# EAGLE design main (EAGLE 6.5.0)
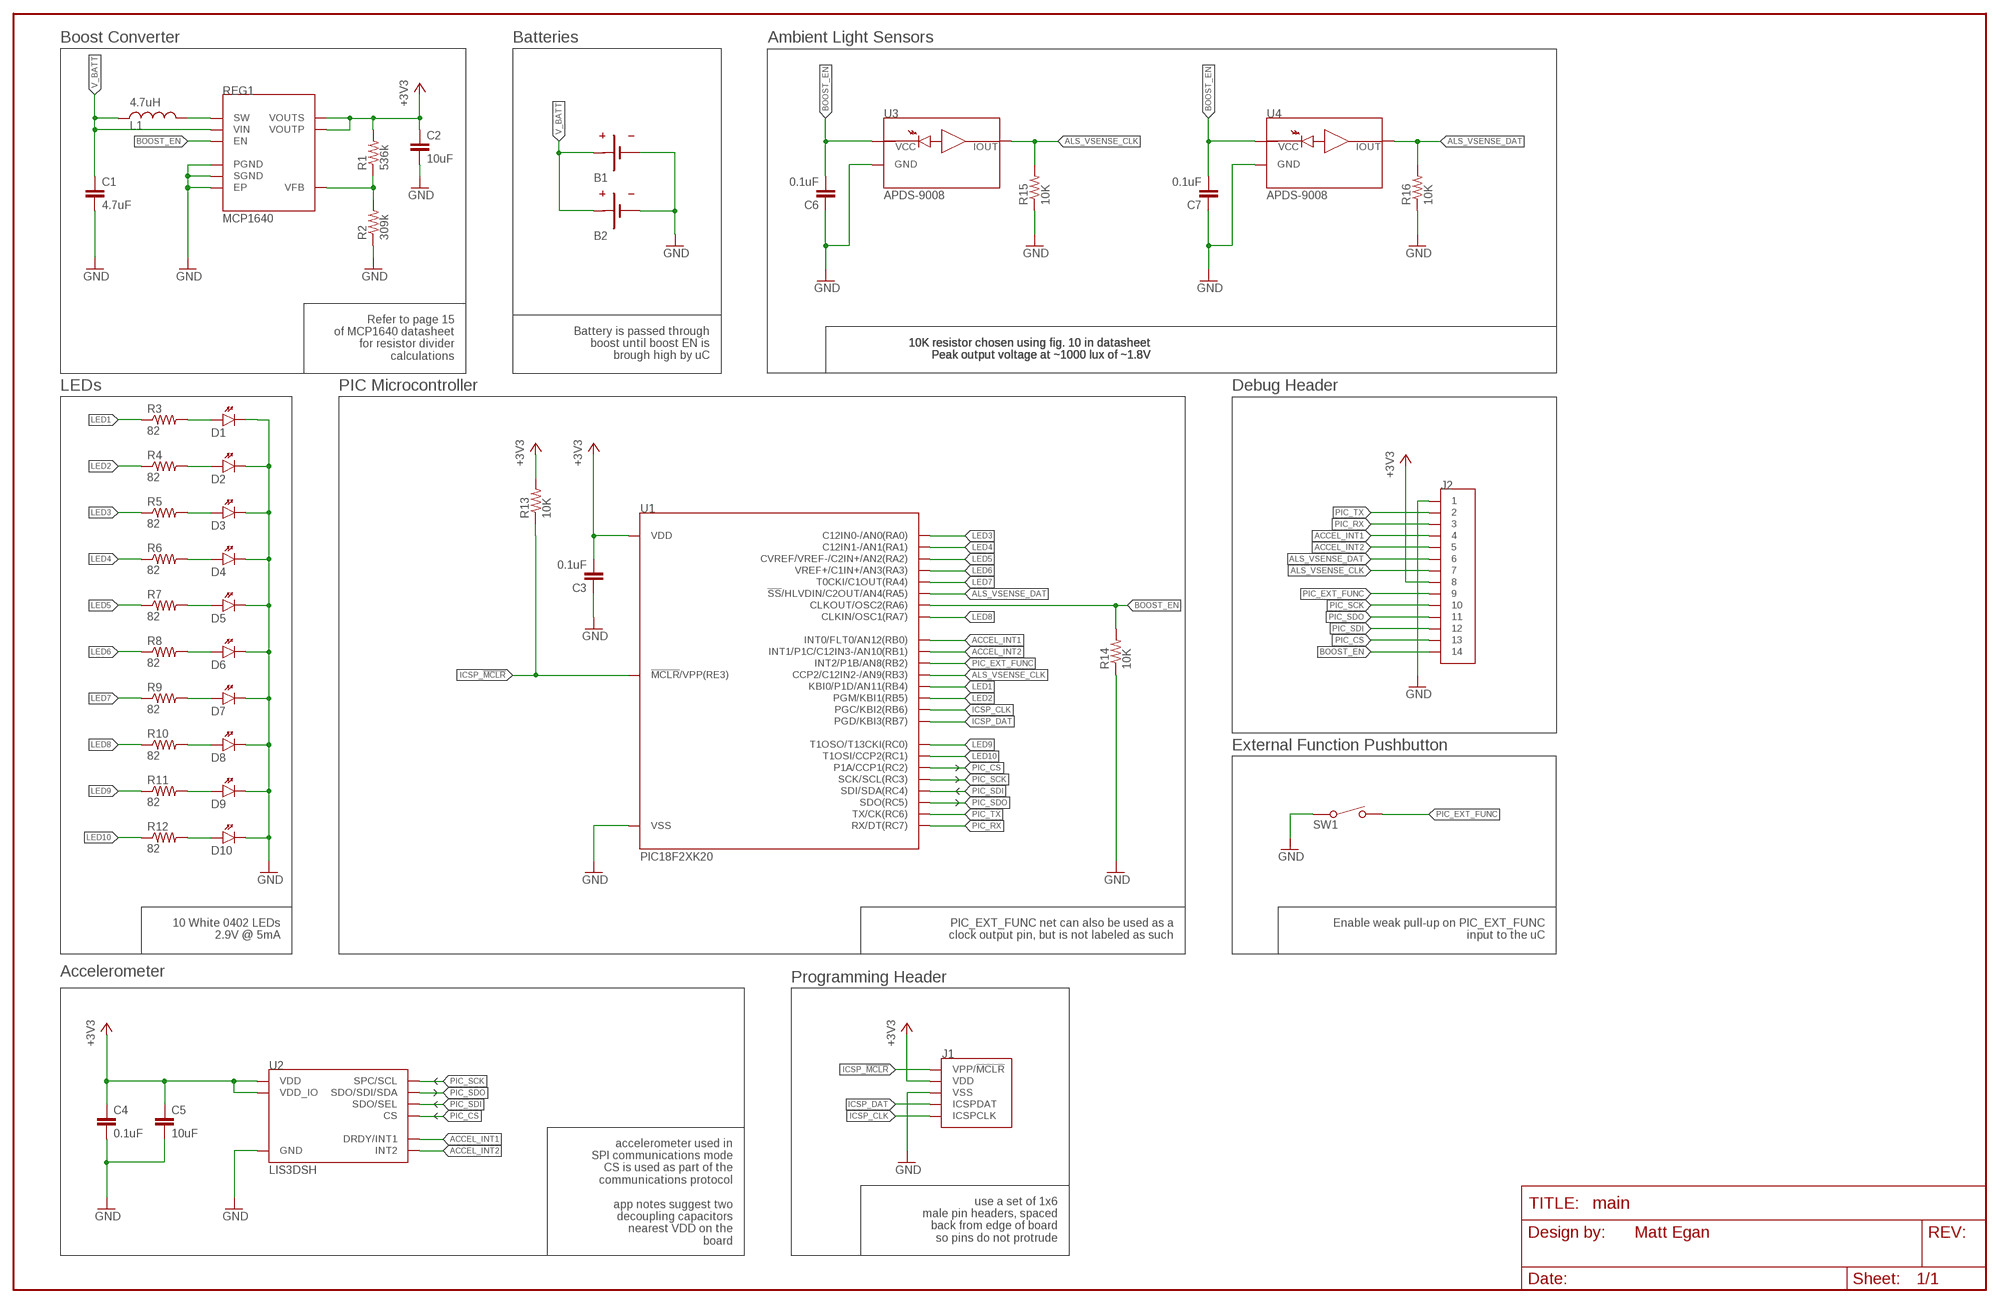
[diagram p0: schematic, sheet 1]

## Parts
B1  BATTERYCR-2016/F2N  [CR-2016/F2N]
B2  BATTERYCR-2016/F2N  [CR-2016/F2N]
C1  4.7uF  CAPACITOR0603  [SMD-0603]
C2  10uF  CAPACITOR0603  [SMD-0603]
C3  0.1uF  CAPACITOR0805  [SMD-0805]
C4  0.1uF  CAPACITOR0805  [SMD-0805]
C5  10uF  CAPACITOR0805  [SMD-0805]
C6  0.1uF  CAPACITOR0805  [SMD-0805]
C7  0.1uF  CAPACITOR0805  [SMD-0805]
D1  LED0603  [SMD-0603-P]
D2  LED0603  [SMD-0603-P]
D3  LED0603  [SMD-0603-P]
D4  LED0603  [SMD-0603-P]
D5  LED0603  [SMD-0603-P]
D6  LED0603  [SMD-0603-P]
D7  LED0603  [SMD-0603-P]
D8  LED0603  [SMD-0603-P]
D9  LED0603  [SMD-0603-P]
D10  LED0603  [SMD-0603-P]
J1  ICSP-HEADER1X6-0.1-ICSP-PADS  [1X6-0.1-ICSP-PADS]
J2  HEADER-141X14-0.05-PADS  [1X14-0.05-PADS]
L1  4.7uH  INDUCTOR  [VLF403210MT]
R1  536k  RESISTOR0603  [SMD-0603]
R2  309k  RESISTOR0603  [SMD-0603]
R3  82  RESISTOR0603  [SMD-0603]
R4  82  RESISTOR0603  [SMD-0603]
R5  82  RESISTOR0603  [SMD-0603]
R6  82  RESISTOR0603  [SMD-0603]
R7  82  RESISTOR0603  [SMD-0603]
R8  82  RESISTOR0603  [SMD-0603]
R9  82  RESISTOR0603  [SMD-0603]
R10  82  RESISTOR0603  [SMD-0603]
R11  82  RESISTOR0603  [SMD-0603]
R12  82  RESISTOR0603  [SMD-0603]
R13  10K  RESISTOR0603  [SMD-0603]
R14  10K  RESISTOR0603  [SMD-0603]
R15  10K  RESISTOR0603  [SMD-0603]
R16  10K  RESISTOR0603  [SMD-0603]
REG1  MCP1640  [DFN-8(2X3)]
SW1  B3U-3000P  [B3U-3000P]
U1  PIC18F2XK20  [QFN-28]
U2  LIS3DSH  [LGA-16]
U3  APDS-9008  [AVAGO-CHIPLED6]
U4  APDS-9008  [AVAGO-CHIPLED6]

## Nets
+3V3: C2.1 C3.2 C4.1 C5.1 J1.P$2(VDD) J2.P$8 R1.2 R13.2 REG1.6(VOUTP) REG1.7(VOUTS) U1.P$17(VDD) U2.P$1(VDD_IO) U2.P$14(VDD) U2.P$15(VDD)
ACCEL_INT1: J2.P$4 U1.P$18(INT0/FLT0/AN12(RB0)) U2.P$11(DRDY/INT1)
ACCEL_INT2: J2.P$5 U1.P$19(INT1/P1C/C12IN3-/AN10(RB1)) U2.P$9(INT2)
ALS_VSENSE_CLK: J2.P$7 R15.2 U1.P$21(CCP2/C12IN2-/AN9(RB3)) U3.P$6(P$IOUT)
ALS_VSENSE_DAT: J2.P$6 R16.2 U1.P$4(!SS!/HLVDIN/C2OUT/AN4(RA5)) U4.P$6(P$IOUT)
BOOST_EN: C6.2 C7.2 J2.P$14 R14.2 REG1.4(EN) U1.P$7(CLKOUT/OSC2(RA6)) U3.P$1(P$VCC) U4.P$1(P$VCC)
GND: B1.P$- B2.P$- C1.2 C2.2 C3.1 C4.2 C5.2 C6.1 C7.1 D1.- D2.- D3.- D4.- D5.- D6.- D7.- D8.- D9.- D10.- J1.P$3(VSS) J2.P$1 R2.1 R14.1 R15.1 R16.1 REG1.2(SGND) REG1.3(PGND) REG1.EP SW1.SW$1 U1.P$5(VSS) U1.P$16(VSS) U2.P$5(GND) U2.P$10(GND) U2.P$12(GND) U2.P$13(GND) U2.P$16(GND) U3.P$4(GND) U4.P$4(GND)
ICSP_!MCLR!: J1.P$1(VPP/!MCLR!) R13.1 U1.P$26(!MCLR!/VPP(RE3))
ICSP_CLK: J1.P$5(ICSPCLK) U1.P$24(PGC/KBI2(RB6))
ICSP_DAT: J1.P$4(ICSPDAT) U1.P$25(PGD/KBI3(RB7))
LED1: R3.1 U1.P$22(KBI0/P1D/AN11(RB4))
LED2: R4.1 U1.P$23(PGM/KBI1(RB5))
LED3: R5.1 U1.P$27(C12IN0-/AN0(RA0))
LED4: R6.1 U1.P$28(C12IN1-/AN1(RA1))
LED5: R7.1 U1.P$1(CVREF/VREF-/C2IN+/AN2(RA2))
LED6: R8.1 U1.P$2(VREF+/C1IN+/AN3(RA3))
LED7: R9.1 U1.P$3(T0CKI/C1OUT(RA4))
LED8: R10.1 U1.P$6(CLKIN/OSC1(RA7))
LED9: R11.1 U1.P$8(T1OSO/T13CKI(RC0))
LED10: R12.1 U1.P$9(T1OSI/CCP2(RC1))
N$3: L1.P$2 REG1.5(SW)
N$5: R1.1 R2.2 REG1.1(VFB)
N$7: D1.+ R3.2
N$8: D2.+ R4.2
N$9: D3.+ R5.2
N$10: D4.+ R6.2
N$11: D5.+ R7.2
N$12: D6.+ R8.2
N$13: D7.+ R9.2
N$14: D8.+ R10.2
N$15: D9.+ R11.2
N$16: D10.+ R12.2
PIC_CS: J2.P$13 U1.P$10(P1A/CCP1(RC2)) U2.P$8(CS)
PIC_EXT_FUNC: J2.P$9 SW1.SW$2 U1.P$20(INT2/P1B/AN8(RB2))
PIC_RX: J2.P$3 U1.P$15(RX/DT(RC7))
PIC_SCK: J2.P$10 U1.P$11(SCK/SCL(RC3)) U2.P$4(SPC/SCL)
PIC_SDI: J2.P$12 U1.P$12(SDI/SDA(RC4)) U2.P$7(SDO/SEL)
PIC_SDO: J2.P$11 U1.P$13(SDO(RC5)) U2.P$6(SDO/SDI/SDA)
PIC_TX: J2.P$2 U1.P$14(TX/CK(RC6))
V_BATT: B1.P$+ B2.P$+ C1.1 L1.P$1 REG1.8(VIN)

## Notes on the sheet
- Boost Converter | Batteries | Ambient Light Sensors
- Refer to page 15
  of MCP1640 datasheet
  for resistor divider
  calculations
- Battery is passed through
  boost until boost EN is
  brough high by uC
- 10K resistor chosen using fig. 10 in datasheet
  Peak output voltage at ~1000 lux of ~1.8V
- 10K resistor chosen using fig. 10 in datasheet
  Peak output voltage at ~1000 lux of ~1.8V
- 10K resistor chosen using fig. 10 in datasheet
  Peak output voltage at ~1000 lux of ~1.8V
- LEDs | PIC Microcontroller | Debug Header
- External Function Pushbutton
- 10 White 0402 LEDs
  2.9V @ 5mA
- PIC_EXT_FUNC net can also be used as a
  clock output pin, but is not labeled as such
- Enable weak pull-up on PIC_EXT_FUNC
  input to the uC
- Accelerometer
- Programming Header
- accelerometer used in
  SPI communications mode
  CS is used as part of the
  communications protocol
  
  app notes suggest two
  decoupling capacitors
  nearest VDD on the
  board
- use a set of 1x6
  male pin headers, spaced
  back from edge of board
  so pins do not protrude
- Matt Egan

## Library data of the parts
B1 B2 = matt:BATTERY: Various battery holders and mounts
C1-C7 = matt:CAPACITOR
D1-D10 = matt:LED
J1 = matt:ICSP-HEADER
J2 = matt:HEADER-14
L1 = matt:INDUCTOR
R1-R16 = matt:RESISTOR
REG1 = matt:MCP1640
SW1 = matt:B3U-3000P
U1 = matt:PIC18F2XK20
U2 = matt:LIS3DSH
U3 U4 = matt:APDS-9008

## Board
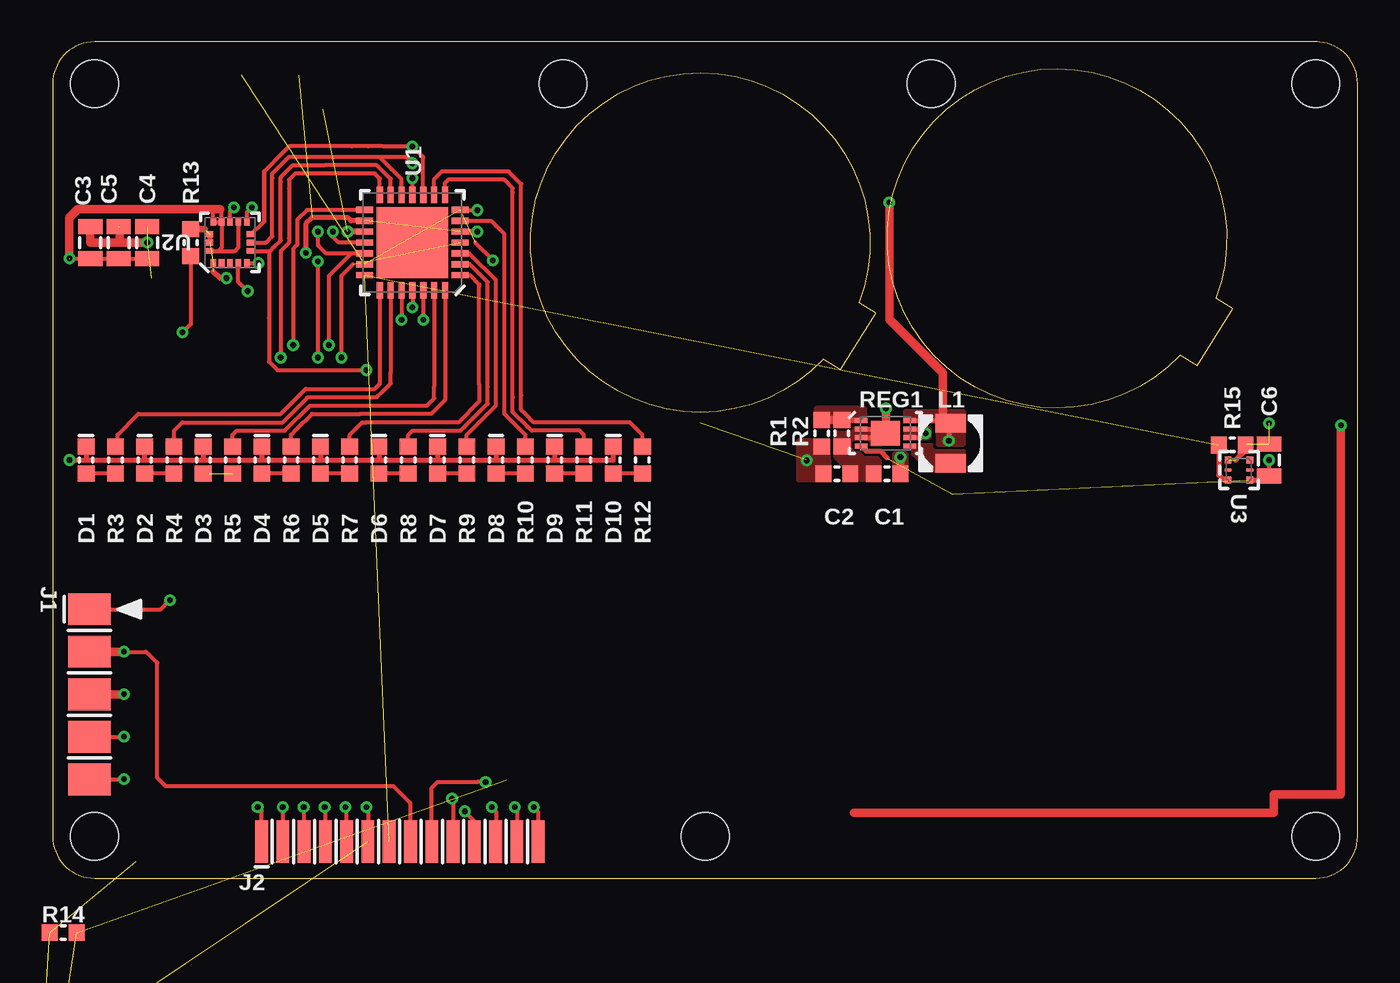
[diagram p1: board, top side]
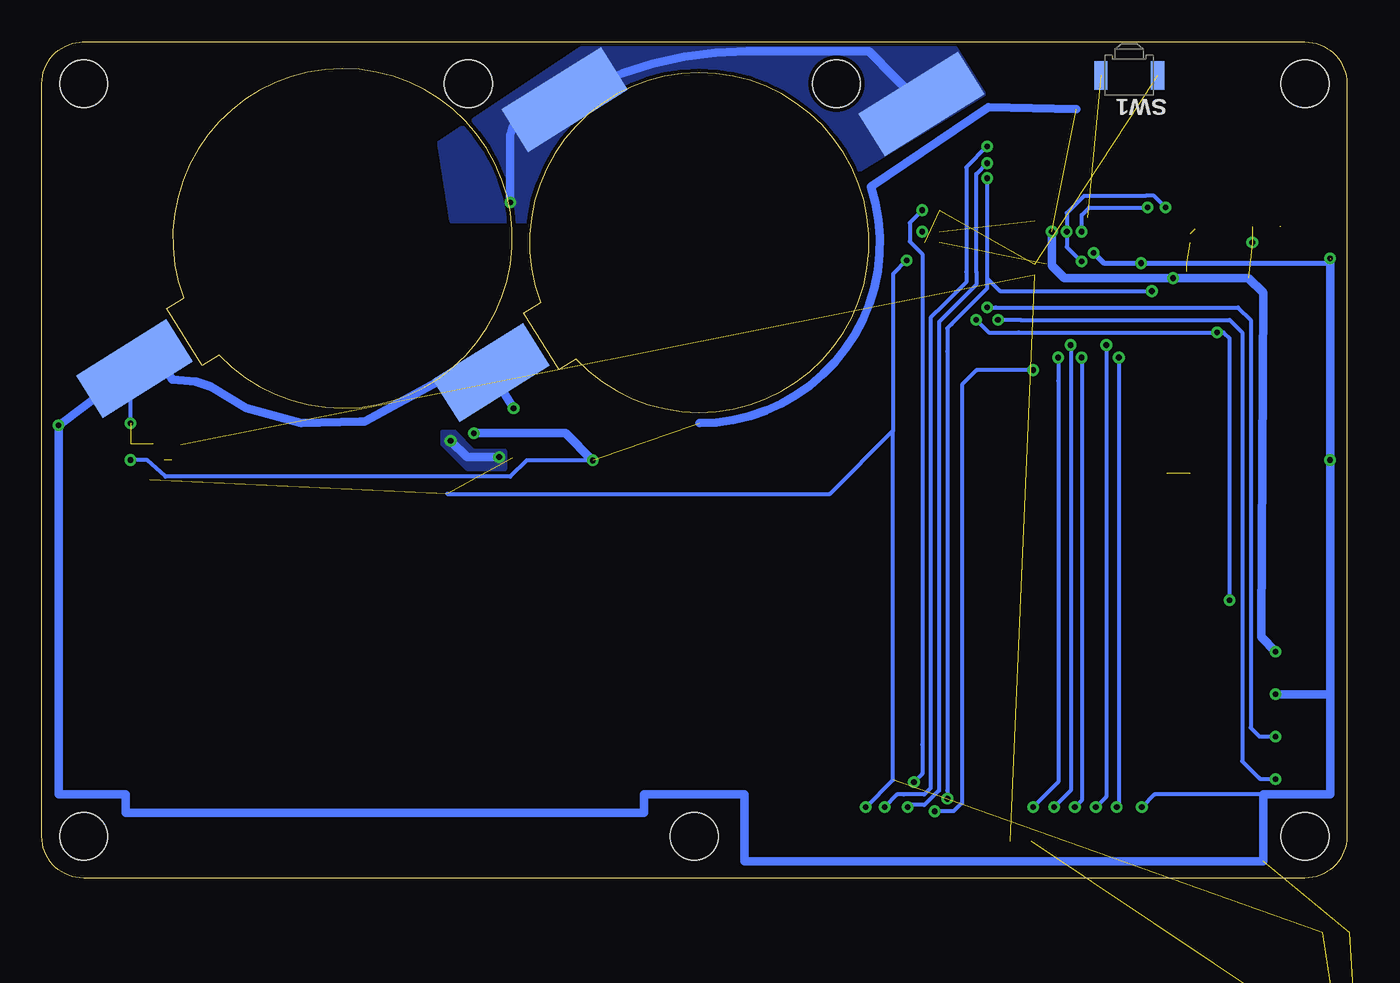
[diagram p2: board, bottom side, seen from below]

Size 78 x 50 mm. Coordinates in mm from the lower left corner, seen from the top.
Outline: 78,47.6 78,2.5 arc-90 75.5,0 2.5,0 arc-90 0,2.5 0,47.5 arc-90 2.5,50 75.6,50
Outline: 78,47.5 arc90 75.5,50
Copper layers (1*16): Top 0.0356mm / dielectric 1.5011mm / Bottom 0.0356mm
Design rules "LaenPCBOrder *": minimum track width 6mil, minimum drill 13mil, track to track 6mil, track to pad 6mil, pad to pad 6mil, via to via 6mil, smd to smd 6mil, copper to edge 10mil, drill to drill 6mil, minimum pad ring 7mil, minimum via ring 7mil, stop-mask expansion 3mil, vias tented up to drill 0mil, thermal gap 10mil
Holes 2.84 mm at 2.5,47.5 2.5,2.5 75.5,2.5 75.5,47.5 30.5,47.5 52.5,47.5 39,2.5

### Footprints (pad centres in the part's own frame; a part is rotated, then mirrored left to right if it is on the bottom)
CR-2016/F2N = smd 7 x 3: P$+ -15.65,0 | smd 6.35 x 3: P$- 14.675,0
SMD-0603 = smd 0.95 x 1: 1 -0.8,0; 2 0.8,0
SMD-0805 = smd 0.9 x 1.45: 1 -0.95,0; 2 0.95,0
SMD-0603-P = smd 0.95 x 1: + -0.8,0; - 0.8,0
1X6-0.1-ICSP-PADS = smd 2.54 x 1.905: P$1 0,5.08; P$2 0,2.54; P$3 0,0; P$4 0,-2.54; P$5 0,-5.08
1X14-0.05-PADS = smd 2.54 x 0.762: P$1 0,8.255; P$2 0,6.985; P$3 0,5.715; P$4 0,4.445; P$5 0,3.175; P$6 0,1.905; P$7 0,0.635; P$8 0,-0.635; P$9 0,-1.905; P$10 0,-3.175; P$11 0,-4.445; P$12 0,-5.715; P$13 0,-6.985; P$14 0,-8.255
VLF403210MT = smd 1.1 x 1.8: P$1 -1.2,0; P$2 1.2,0
DFN-8(2X3) = smd 0.3 x 0.75: 1 -0.75,-1.45; 2 -0.25,-1.45; 3 0.25,-1.45; 4 0.75,-1.45; 5 0.75,1.45; 6 0.25,1.45; 7 -0.25,1.45; 8 -0.75,1.45 | smd 1.45 x 1.75: EP 0,0
B3U-3000P = smd 0.8 x 1.7: SW$1 -1.7,0; SW$2 1.7,0
QFN-28 = smd 1 x 0.37: P$1 -2.85,1.95; P$2 -2.85,1.3; P$3 -2.85,0.65; P$4 -2.85,0; P$5 -2.85,-0.65; P$6 -2.85,-1.3; P$7 -2.85,-1.95; P$15 2.85,-1.95; P$16 2.85,-1.3; P$17 2.85,-0.65; P$18 2.85,0; P$19 2.85,0.65; P$20 2.85,1.3; P$21 2.85,1.95 | smd 0.37 x 1: P$8 -1.95,-2.85; P$9 -1.3,-2.85; P$10 -0.65,-2.85; P$11 0,-2.85; P$12 0.65,-2.85; P$13 1.3,-2.85; P$14 1.95,-2.85; P$22 1.95,2.85; P$23 1.3,2.85; P$24 0.65,2.85; P$25 0,2.85; P$26 -0.65,2.85; P$27 -1.3,2.85; P$28 -1.95,2.85 | smd 4.25 x 4.25: P$29 0,0
LGA-16 = smd 0.45 x 0.34: P$1 -1.225,1; P$2 -1.225,0.5; P$3 -1.225,0; P$4 -1.225,-0.5; P$5 -1.225,-1; P$9 1.225,-1; P$10 1.225,-0.5; P$11 1.225,0; P$12 1.225,0.5; P$13 1.225,1 | smd 0.34 x 0.45: P$6 -0.5,-1.225; P$7 0,-1.225; P$8 0.5,-1.225; P$14 0.5,1.225; P$15 0,1.225; P$16 -0.5,1.225
AVAGO-CHIPLED6 = smd 0.4 x 0.4: P$1 0.6,0.65; P$3 -0.6,0.65; P$4 -0.6,-0.65; P$6 0.6,-0.65 | smd 0.2 x 0.4: P$2 0,0.65; P$5 0,-0.65

### Placement (x,y rotation side)
B1  60.02,38.25 212 bottom
B2  38.7,38 212 bottom
C1  49.87,24.17 180 top
C2  46.87,24.17 0 top
C3  2.25,38 90 top
C4  5.65,38 270 top
C5  3.95,38 270 top
C6  72.7,25 270 top
C7  0.75,-15.88 0 top  (outside the outline)
D1  2,25 90 top
D2  5.5,25 90 top
D3  9,25 90 top
D4  12.5,25 90 top
D5  16,25 90 top
D6  19.5,25 90 top
D7  23,25 90 top
D8  26.5,25 90 top
D9  30,25 90 top
D10  33.5,25 90 top
J1  2.2,11 0 top
J2  20.75,2.2 90 top
L1  53.67,26 270 top
R1  45.97,26.6 270 top
R2  47.17,26.6 90 top
R3  3.75,25 270 top
R4  7.25,25 270 top
R5  10.75,25 270 top
R6  14.25,25 270 top
R7  17.75,25 270 top
R8  21.25,25 270 top
R9  24.75,25 270 top
R10  28.25,25 270 top
R11  31.75,25 270 top
R12  35.25,25 270 top
R13  8.25,38 90 top
R14  0.62,-3.25 0 top  (outside the outline)
R15  70.5,25.9 180 top
R16  0.62,-12.62 0 top  (outside the outline)
REG1  49.77,26.6 270 top
SW1  13,48 0 bottom
U1  21.5,38 180 top
U2  10.6,38 90 top
U3  70.9,24.4 270 top
U4  0,-9.38 0 top  (outside the outline)

### Tracks (layer width: path | path; a pad name or v marks a point on that pad's centre or on a via)
+3V3  (via drill 0.34 pad 0.25)  (8 unrouted)
  Top 0.25: 46.1,24.14 C2.1 | v72.7,25 72.7,24.15 | J2.P$8 21.39,4.49 20.38,5.5 6.75,5.5 6.25,6 6.25,12.88 5.58,13.54 4.12,13.54
  Top 0.3: REG1.7 51.92,26.85 v52.17,26.6 51.92,26.35 REG1.6 | v45.07,24.98 45.04,25 | U2.P$14 U2.P$15
  Top 0.34: 9.6,36.27 10,35.88 v10.38,35.88
  Top 0.37: U1.P$17 v17.62,38.65
  Top 0.4: R13.2 9.07,38.8
  Top 0.5: v5.65,38 4,38 | 4,38 2.25,38 C3.2 | 4,38.95 4,38 | J1.P$2 4.12,13.54 v4.25,13.54
  Bottom 0.25: v45.07,24.98 49.02,24.98 50,24 70.6,24 71.7,25 v72.7,25
  Bottom 0.5: v52.17,26.6 46.7,26.6 v45.07,24.98 | 38.7,27.2 arc-108 28.43,41.34 21.42,46.1 16.15,45.98 | v17.62,38.65 17.62,36.62 16.88,35.88 v10.38,35.88 5.88,35.88 5,35 5.12,14.75 5.12,14.41 v4.25,13.54
  pour Top (no thermals): 50.99,26.35 52.39,26.35 52.39,26.85 50.99,26.85
  pour Top (rank 2, no thermals): 46.39,23.82 46.39,26.12 44.57,26.12 44.57,23.82
ACCEL_INT1  (via drill 0.34 pad 0.25)
  Top 0.25: U1.P$18 17.1,38 16.74,38.36 v16.74,38.65 | v15.85,36.88 v15.85,31.12 | J2.P$4 16.3,4.2 v16.25,4.25 | U2.P$11 10.6,39.88 v10.82,40.1
  Bottom 0.25: v15.85,36.88 15.88,36.88 16.74,37.74 v16.74,38.65 16.74,39.76 15.7,40.8 12.03,40.8 11.53,40.8 v10.82,40.1 | v15.85,31.12 15.85,4.65 v16.25,4.25
ACCEL_INT2  (via drill 0.34 pad 0.25)
  Top 0.25: v15.85,38.65 15.85,37.85 15.9,37.8 16.35,37.35 U1.P$19 17.85,37.35 16.5,36 v16.5,31.88 | v11.9,40.1 11.6,39.8 U2.P$9 | J2.P$5 17.57,4.17 v17.5,4.25
  Bottom 0.25: v15.85,38.65 15.85,39.65 15.4,40.1 v11.9,40.1 | v16.5,31.88 16.5,5.25 v17.5,4.25
ALS_VSENSE_CLK  (2 unrouted)
  Top 0.3: R15.2 69.7,24.1 70,23.8 U3.P$6
ALS_VSENSE_DAT  (via drill 0.34 pad 0.25)  (3 unrouted)
  Top 0.25: 17.95,36.7 17.25,36 17.25,31.25 v17.25,31.12 | v18.75,4.25 18.84,4.16 J2.P$6
  Bottom 0.25: v17.25,31.12 17.25,29.75 17.25,5.75 v18.75,4.25
BOOST_EN  (via drill 0.34 pad 0.25)  (6 unrouted)
  Top 0.25: J2.P$14 29,4 v28.75,4.25 | 25.25,38 v26.31,36.94 | 72.45,23.8 C6.2
  Top 0.3: REG1.4 48.65,25.52 49.47,25.52 49.87,25.12 | U3.P$1 72.45,23.8 | 72.7,24 C6.2
  Bottom 0.25: 27.12,26.75 27.12,36.12 v26.31,36.94 | 53.77,22.98 30.9,22.98 27.12,26.75 | v28.75,4.25 27.12,5.88 27.12,26.75
GND  (via drill 0.34 pad 0.25)  (10 unrouted)
  Top 0.25: U2.P$12 U2.P$13 9.6,39.9 9.5,40 | U2.P$16 9.9,37.5 | 9.9,37.5 10.9,37.5 11.1,37.7 U2.P$10 | 9.9,37.5 10.1,37.7 U2.P$12 | 2.2,37 C3.1 | v1,37.05 C3.1 | C3.1 C5.2 C4.2 | 50.25,4 47.9,3.9 | 63.25,4 63.5,3.9 | D9.- 29.9,25.8 29.9,25.7 | U2.P$12 10.1,39.9 10,40 | J2.P$1 12.49,4 v12.25,4.25 | U2.P$5 v12.3,36.77
  Top 0.3: REG1.3 49.52,26.35 REG1.EP 49.52,26.85 REG1.2 | 70.7,25 71.3,25.6 R15.1 | v1,25 2,25 | 2,25 5.47,25 | 5.47,25 9,25 | 9,25 12.5,25 | 16,25 19.5,25 | 23,25 26.5,25 | 26.5,25 29.98,25 30,25 | 30,25 33.5,25 D10.- | 29.85,25.8 D9.- 30,25 | D1.- 2,25 | D2.- 5.5,25.62 5.47,25.6 5.47,25 | D3.- 9,25 | D4.- 12.5,25 | 12.5,25 12.55,25 15.93,25 16,25 | D5.- 16,25 | D6.- 19.5,25 | 19.5,25 19.52,25 22.9,25 23,25 | D7.- 23,25 | D8.- 26.5,25 | U1.P$16 17.82,39.3 17.62,39.5 15.5,39.5 15.12,39.12 15.12,38.88 v15.12,37.38
  Top 0.37: U1.P$5 v25.38,38.65
  Top 0.5: 71.35,25.95 R15.1 | 47.7,24.14 C2.2 | 49.52,26.85 arc90 49.8,27.13 v49.8,28.1 | v77,27.07 77,5 73,5 73,3.9 63.5,3.9 47.9,3.9 | v1,37.05 1,39.5 1.5,40 9.5,40 10,40 | J1.P$3 v4.25,11
  Bottom 0.25: v72.7,27.2 72.7,29.08 B1.P$- | 4.75,5 11.5,5 v12.25,4.25
  Bottom 0.3: v15.12,37.38 14.53,36.77 v12.3,36.77 1.27,36.77 arc90 1,36.5
  Bottom 0.5: 1,10.88 1,5 4.75,5 5,5 5,1 36,1 36,5 42,5 42,3.9 73,3.9 73,5 77,5 v77,27.07 B1.P$- 70.8,30.8 70.2,29.8 68.8,29.7 67.9,29.4 65.8,28.1 62.5,27.2 58.98,27.29 58.7,27.3 54.3,29.7 B2.P$- v49.8,28.1 | 1,10.88 v1,25 1,36.5 1,37 | v4.25,11 1.12,11 1,10.88
  pour Top (no thermals): 49.39,23.82 47.52,23.82 47.52,24.47 46.82,25.17 46.82,26.85 49.39,26.85
ICSP_!MCLR!  (via drill 0.34 pad 0.25)
  Top 0.25: J1.P$1 6.46,16.08 v7,16.62 | R13.1 8.25,33.12 v7.75,32.62 | U1.P$26 v22.15,33.38
  Bottom 0.25: v7,16.62 7,18.12 7,32.12 7,32.25 7.38,32.62 v7.75,32.62 19.62,32.62 21.4,32.62 v22.15,33.38
ICSP_CLK  (via drill 0.34 pad 0.25)
  Top 0.25: U1.P$24 v20.85,33.38 | J1.P$5 v4.25,5.92
  Bottom 0.25: v20.85,33.38 19.5,33.38 7,33.38 6.25,32.62 6.25,7 5.25,6 5.17,5.92 v4.25,5.92
ICSP_DAT  (via drill 0.34 pad 0.25)
  Top 0.25: U1.P$25 v21.5,34.12 | J1.P$4 v4.25,8.46
  Bottom 0.25: v21.5,34.12 21,34.12 6.5,34.12 5.75,33.38 5.75,9 5.21,8.46 v4.25,8.46
LED1
  Top 0.25: U1.P$22 19.55,29.55 19.25,29.25 15.12,29.25 13.62,27.75 5.12,27.75 3.88,26.5 3.88,25.93 R3.1
LED2
  Top 0.25: U1.P$23 20.2,30.25 | 20.2,30.25 20.2,30.2 | R4.1 7.25,26.75 7.62,27.12 7.75,27.25 13.75,27.25 15.12,28.62 15.25,28.75 19.38,28.75 19.75,29.12 20.2,29.57 20.2,30.25
LED3
  Top 0.25: U1.P$27 22.8,29.43 22.8,28.68 22.75,28.62 22.38,28.25 20,28.25 15.38,28.25 13.88,26.75 13.75,26.75 11,26.75 10.88,26.62 10.75,26.5 R5.1
LED4
  Top 0.25: U1.P$28 23.45,28.57 22.62,27.75 18.38,27.75 15.5,27.75 14.62,26.88 14.25,26.5 R6.1
LED5
  Top 0.25: U1.P$1 24.95,36.05 25,36 25.5,35.5 25.5,35.38 25.5,29.5 25.5,28.5 24.25,27.25 18.75,27.25 18.5,27.25 17.88,26.62 17.75,26.5 R7.1
LED6
  Top 0.25: U1.P$2 24.93,36.7 26,35.62 26,29.38 26,28.38 24.62,27 24.38,26.75 21.5,26.75 21.25,26.5 R8.1
LED7
  Top 0.25: U1.P$3 24.9,37.35 26.5,35.75 26.5,28.38 26.5,28.25 25,26.75 24.75,26.5 R9.1
LED8
  Top 0.25: R10.1 28.25,26.5 27,27.75 27,38.5 26.5,39 26.2,39.3 U1.P$6
LED9
  Top 0.25: U1.P$8 23.45,41.58 23.5,41.62 23.62,41.75 27,41.75 27.5,41.25 27.5,41 27.5,28.75 27.5,27.88 28.38,27 28.62,26.75 31.5,26.75 31.75,26.5 R11.1
LED10
  Top 0.25: U1.P$9 22.8,41.8 23.25,42.25 27.25,42.25 28,41.5 28,28.88 28,28 28.25,27.75 28.75,27.25 34.5,27.25 34.62,27.12 35,26.75 35.25,26.5 R12.1
N$3
  pour Top (rank 3, no thermals): 54.42,24.4 54.42,25.85 50.99,25.85 52.12,24.72 52.12,24.4
N$5
  Top 0.3: REG1.1 47.02,27.35 R2.2
  Top 0.5: R1.1 R2.2
  pour Top (rank 3, no thermals): 48.54,27.35 48.54,28.07 45.62,28.07 45.62,27.35
N$7
  Top 0.25: R3.2 D1.+
N$8
  Top 0.25: R4.2 5.85,24.2 D2.+
N$9  (1 unrouted)
  Top 0.25: 9.35,24.2 D3.+
N$10
  Top 0.25: R6.2 12.85,24.2 D4.+
N$11
  Top 0.25: R7.2 16.35,24.2 D5.+
N$12
  Top 0.25: R8.2 19.85,24.2 D6.+
N$13
  Top 0.25: R9.2 23.35,24.2 D7.+
N$14
  Top 0.25: R10.2 26.85,24.2 D8.+
N$15
  Top 0.25: R11.2 30.35,24.2 D9.+
N$16
  Top 0.25: R12.2 33.85,24.2 D10.+
PIC_CS  (via drill 0.34 pad 0.25)
  Top 0.25: U2.P$8 11.88,38.5 12.62,39.25 | 12.62,42.25 13.75,43.38 14.12,43.75 17.88,43.75 18.88,43.75 19.75,43.75 20.12,43.75 20.38,43.75 v21.5,43.75 21.94,43.31 | 21.94,43.31 22.12,43.12 | U1.P$10 22.15,43.1 21.94,43.31 | v27.62,4.25 27.75,4.12 27.75,2.88 27.73,2.86 J2.P$13
  Top 0.254: 12.62,39.25 12.62,42.25
  Bottom 0.25: v21.5,43.75 22.75,42.5 22.75,36.25 22.75,35.62 24.12,34.25 24.88,33.5 24.88,31.88 24.88,5.62 24.88,5.38 25.25,5 26.5,5 26.88,5 v27.62,4.25
PIC_EXT_FUNC  (via drill 0.34 pad 0.25)  (2 unrouted)
  Top 0.25: 24.36,39.94 v25.38,39.94 | v25.88,5.75 25.38,5.75 23,5.75 22.66,5.41 J2.P$9
  Bottom 0.25: v25.38,39.94 26.12,39.19 26.12,38.06 25.38,37.31 25.38,8 25.38,6.25 v25.88,5.75
PIC_RX  (via drill 0.34 pad 0.25)
  Top 0.25: U1.P$15 15.2,39.95 14.62,39.38 14.62,38.25 14.62,37.88 14.38,37.62 14.38,37.12 14.38,33.5 v14.38,31.88 | 15,4.12 v15,4.25 15.04,4.21 J2.P$3
  Bottom 0.25: v14.38,31.88 14.38,4.88 v15,4.25
PIC_SCK  (via drill 0.34 pad 0.25)
  Top 0.25: U1.P$11 v21.5,41.85 | v11.65,35.1 11.1,35.65 U2.P$4 | v23.88,4.75 23.93,4.83 J2.P$10
  Bottom 0.25: v21.5,41.85 21.5,36 21.5,35.88 | v11.65,35.1 20.73,35.1 21.5,35.88 | 21.5,35.88 21.5,35.25 23.62,33.12 23.88,32.88 23.88,31.5 23.88,5.25 v23.88,4.75
PIC_SDI  (via drill 0.34 pad 0.25)
  Top 0.25: U2.P$7 12.75,38 13.12,38.38 13.12,41.88 13.12,42.12 14,43 14.12,43.12 19.5,43.12 | 19.5,43.12 21.12,43.12 v21.5,42.75 | U1.P$12 20.85,41.77 20.25,42.38 19.5,43.12 | v26.25,4.25 26.5,4 26.5,2.88 26.46,2.84 J2.P$12
  Bottom 0.25: v21.5,42.75 22.15,42.1 22.15,42.05 22.15,36.25 22.15,35.48 24.12,33.5 24.38,33.25 24.38,31.5 24.38,5.25 25.25,4.38 26.12,4.38 v26.25,4.25
PIC_SDO  (via drill 0.34 pad 0.25)
  Top 0.25: U2.P$6 13,37.5 | 13,37.5 13.25,37.75 13.62,38.12 13.62,41.62 13.62,41.9 14.35,42.62 16.25,42.62 19.38,42.62 20.2,41.8 U1.P$13 | 13,37.5 12.94,37.44 12.94,33.5 12.94,30.88 13.44,30.38 15,30.38 v18.75,30.38 | J2.P$11 25.2,3.31 25.2,3.43 v24.62,4
  Bottom 0.25: v18.75,30.38 22.12,30.38 23,29.5 23,27.88 23,5.38 23,4.5 23.5,4 v24.62,4
PIC_TX  (via drill 0.34 pad 0.25)
  Top 0.25: U1.P$14 19.55,41.83 19.25,42.12 18,42.12 14.5,42.12 14.12,41.75 14.12,41.25 14.12,38.25 14.12,38 13.62,37.5 13.62,33.5 v13.62,31.12 | J2.P$2 13.77,4.24 v13.75,4.25
  Bottom 0.25: v13.62,31.12 13.62,4.38 v13.75,4.25
V_BATT  (via drill 0.34 pad 0.25)
  Top 0.25: C1.1 50.94,23.9
  Top 0.3: REG1.8 53.52,27.35 L1.P$1 53.57,27.2 v53.57,26.15 | 50.67,24.5 C1.1
  Top 0.5: v50.67,25.18 C1.1 | v50,40.4 50,33.4 53.2,30.2 53.2,27.67 L1.P$1
  Bottom 0.3: v53.57,26.15 53.6,26.18
  Bottom 0.5: v53.57,26.15 52.59,25.18 v50.67,25.18 | B2.P$+ 25.49,46.29 28.55,49.45 35.85,49.45 arc-29 B1.P$+ arc-90 50,44.42 v50,40.4
  pour Top (rank 2, no thermals): 50.99,27.35 50.99,27.9 54.42,27.9 54.42,27.35
  pour Top (no thermals): 54.42,26.8 52.92,26.8 52.92,25.95 54.42,25.95
  pour Bottom: 54.02,25.95 54.02,26.67 53.34,26.67 52.24,25.55 50.34,25.55 50.34,24.45 52.52,24.45
  pour Top (no thermals): 50.99,24.52 50.34,24.52 50.34,25.37 50.99,25.37
  pour Bottom (no thermals): 21.66,46.87 30.5,41.5 30.5,39.25 53.5,39.25 54.25,44 44.5,50.5 23.92,50.5